# EAGLE schematic center_v1 (EAGLE 9.5.0)
REV: p1; TITLE: Elemental Center
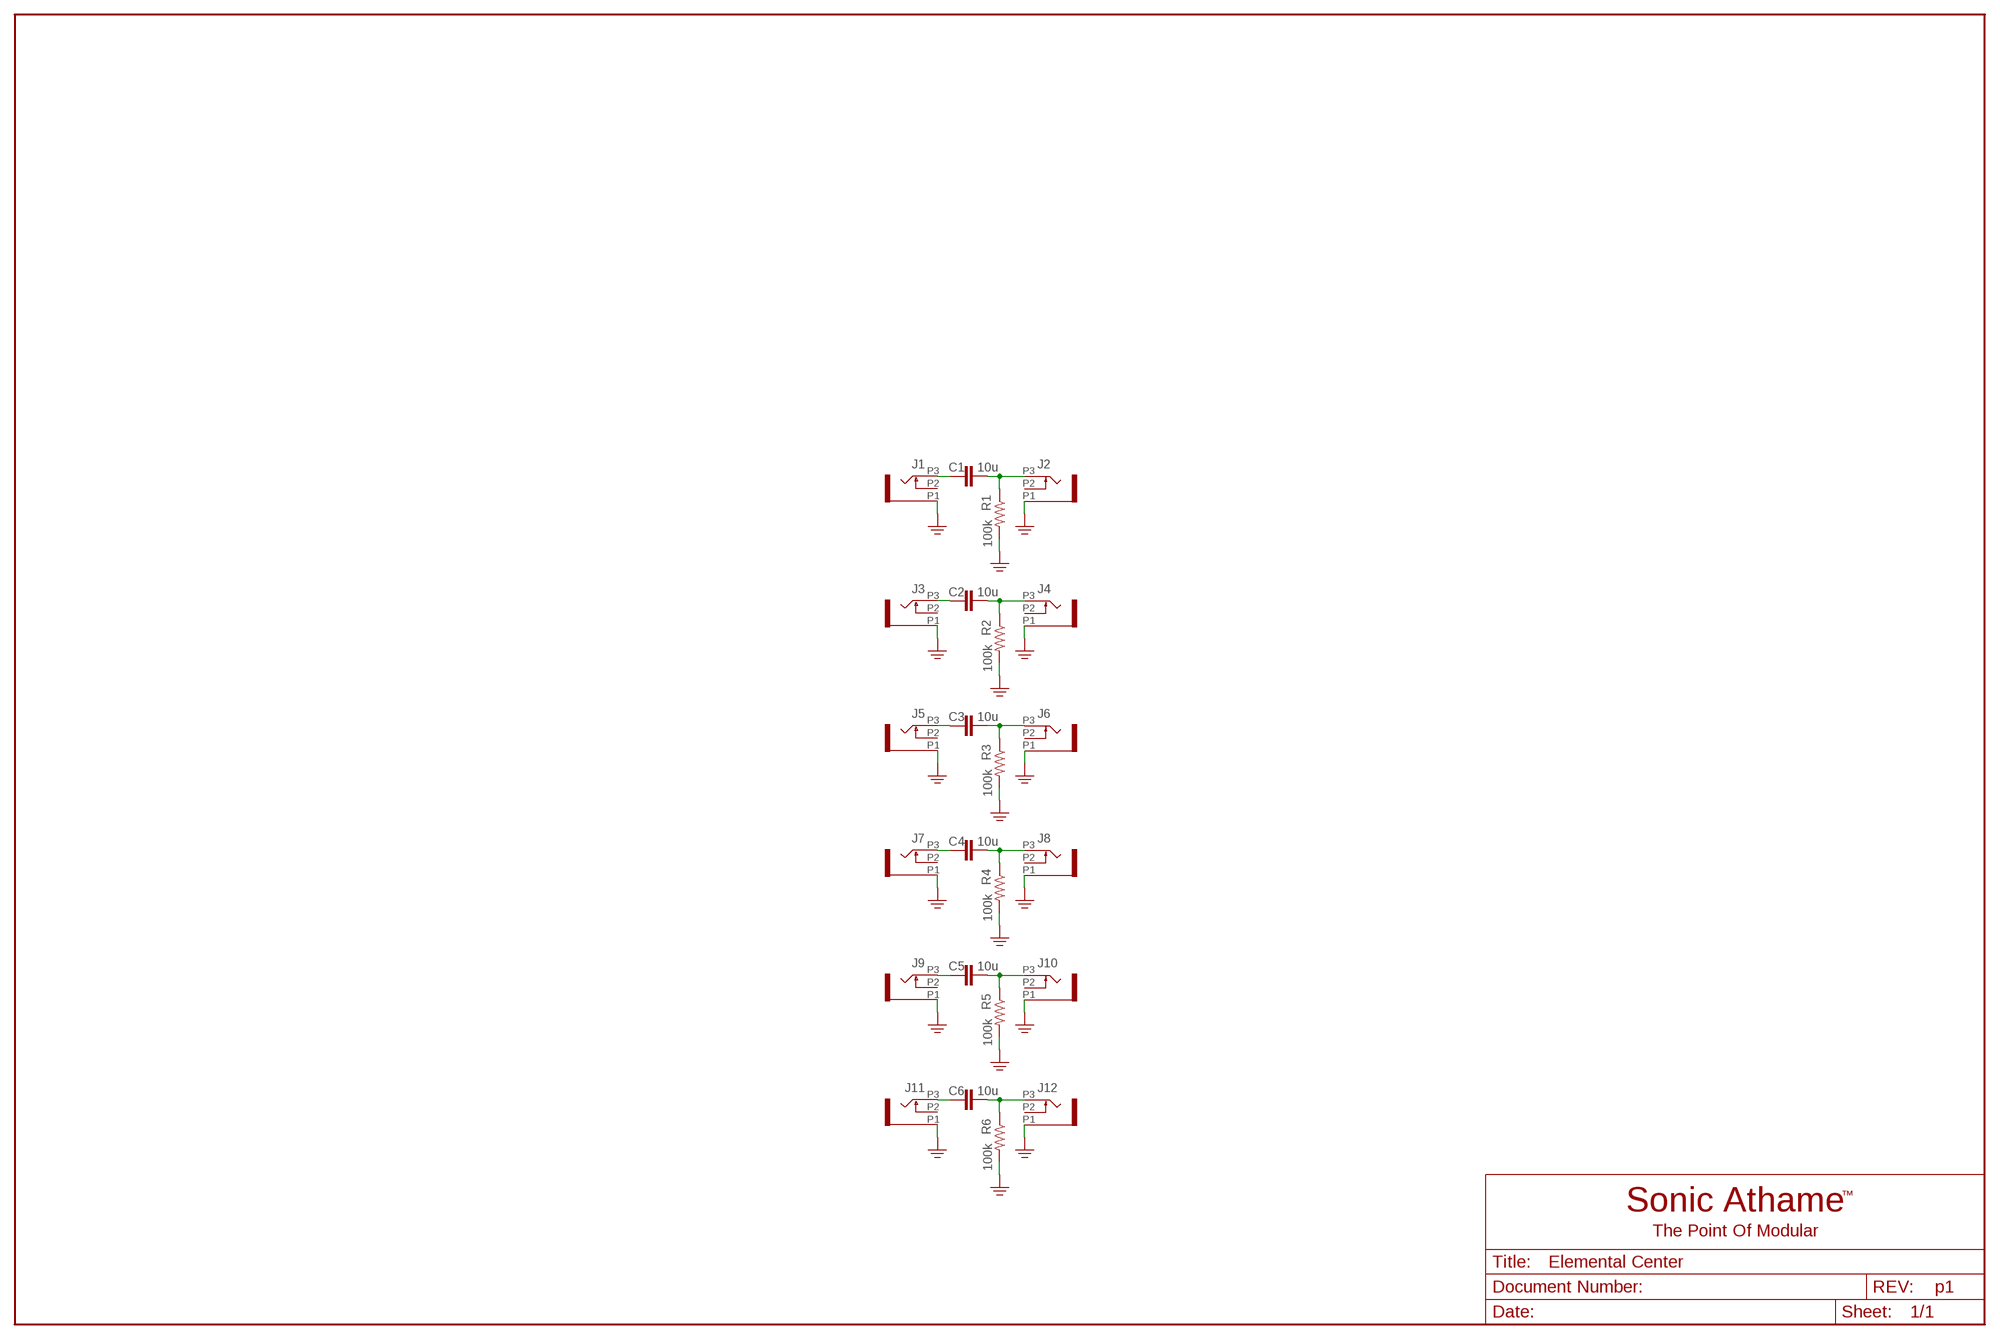
[diagram p0: schematic, sheet 1]

## Parts
C1  10u  CAP_NONPOL050-024X044  [C050-024X044]
C2  10u  CAP_NONPOL050-024X044  [C050-024X044]
C3  10u  CAP_NONPOL050-024X044  [C050-024X044]
C4  10u  CAP_NONPOL050-024X044  [C050-024X044]
C5  10u  CAP_NONPOL050-024X044  [C050-024X044]
C6  10u  CAP_NONPOL050-024X044  [C050-024X044]
J1  WQP-PJ398SM6  [WQP_PJ_301M6]
J2  WQP-PJ398SM6  [WQP_PJ_301M6]
J3  WQP-PJ398SM6  [WQP_PJ_301M6]
J4  WQP-PJ398SM6  [WQP_PJ_301M6]
J5  WQP-PJ398SM6  [WQP_PJ_301M6]
J6  WQP-PJ398SM6  [WQP_PJ_301M6]
J7  WQP-PJ398SM6  [WQP_PJ_301M6]
J8  WQP-PJ398SM6  [WQP_PJ_301M6]
J9  WQP-PJ398SM6  [WQP_PJ_301M6]
J10  WQP-PJ398SM6  [WQP_PJ_301M6]
J11  WQP-PJ398SM6  [WQP_PJ_301M6]
J12  WQP-PJ398SM6  [WQP_PJ_301M6]
R1  100k  RESISTOR0207/2V  [0207/2V]
R2  100k  RESISTOR0207/2V  [0207/2V]
R3  100k  RESISTOR0207/2V  [0207/2V]
R4  100k  RESISTOR0207/2V  [0207/2V]
R5  100k  RESISTOR0207/2V  [0207/2V]
R6  100k  RESISTOR0207/2V  [0207/2V]

## Nets
GND: J1.P1 J2.P1 J3.P1 J4.P1 J5.P1 J6.P1 J7.P1 J8.P1 J9.P1 J10.P1 J11.P1 J12.P1 R1.2 R2.2 R3.2 R4.2 R5.2 R6.2
N$1: C1.1 J1.P3
N$2: C1.2 J2.P3 R1.1
N$3: C2.2 J4.P3 R2.1
N$4: C2.1 J3.P3
N$5: C3.2 J6.P3 R3.1
N$6: C3.1 J5.P3
N$7: C4.1 J7.P3
N$8: C4.2 J8.P3 R4.1
N$9: C5.1 J9.P3
N$10: C5.2 J10.P3 R5.1
N$11: C6.2 J12.P3 R6.1
N$12: C6.1 J11.P3
Unconnected: J1.P2 J2.P2 J3.P2 J4.P2 J5.P2 J6.P2 J7.P2 J8.P2 J9.P2 J10.P2 J11.P2 J12.P2

## Library data of the parts
C1-C6 = SonicAthame:CAP_NONPOL: CAPACITOR, European symbol; SPICEPREFIX: C
J1-J12 = SonicAthame:WQP-PJ398SM
R1-R6 = SonicAthame:RESISTOR: RESISTOR, American symbol; SPICEPREFIX: R